# Altium schematic sheet ADC_1_PLEIADES.SchDoc
size Tabloid; SheetNumber: 9; SheetTotal: 10; Sheet_Name: Insert name in Document Parameters; Size: 11x17
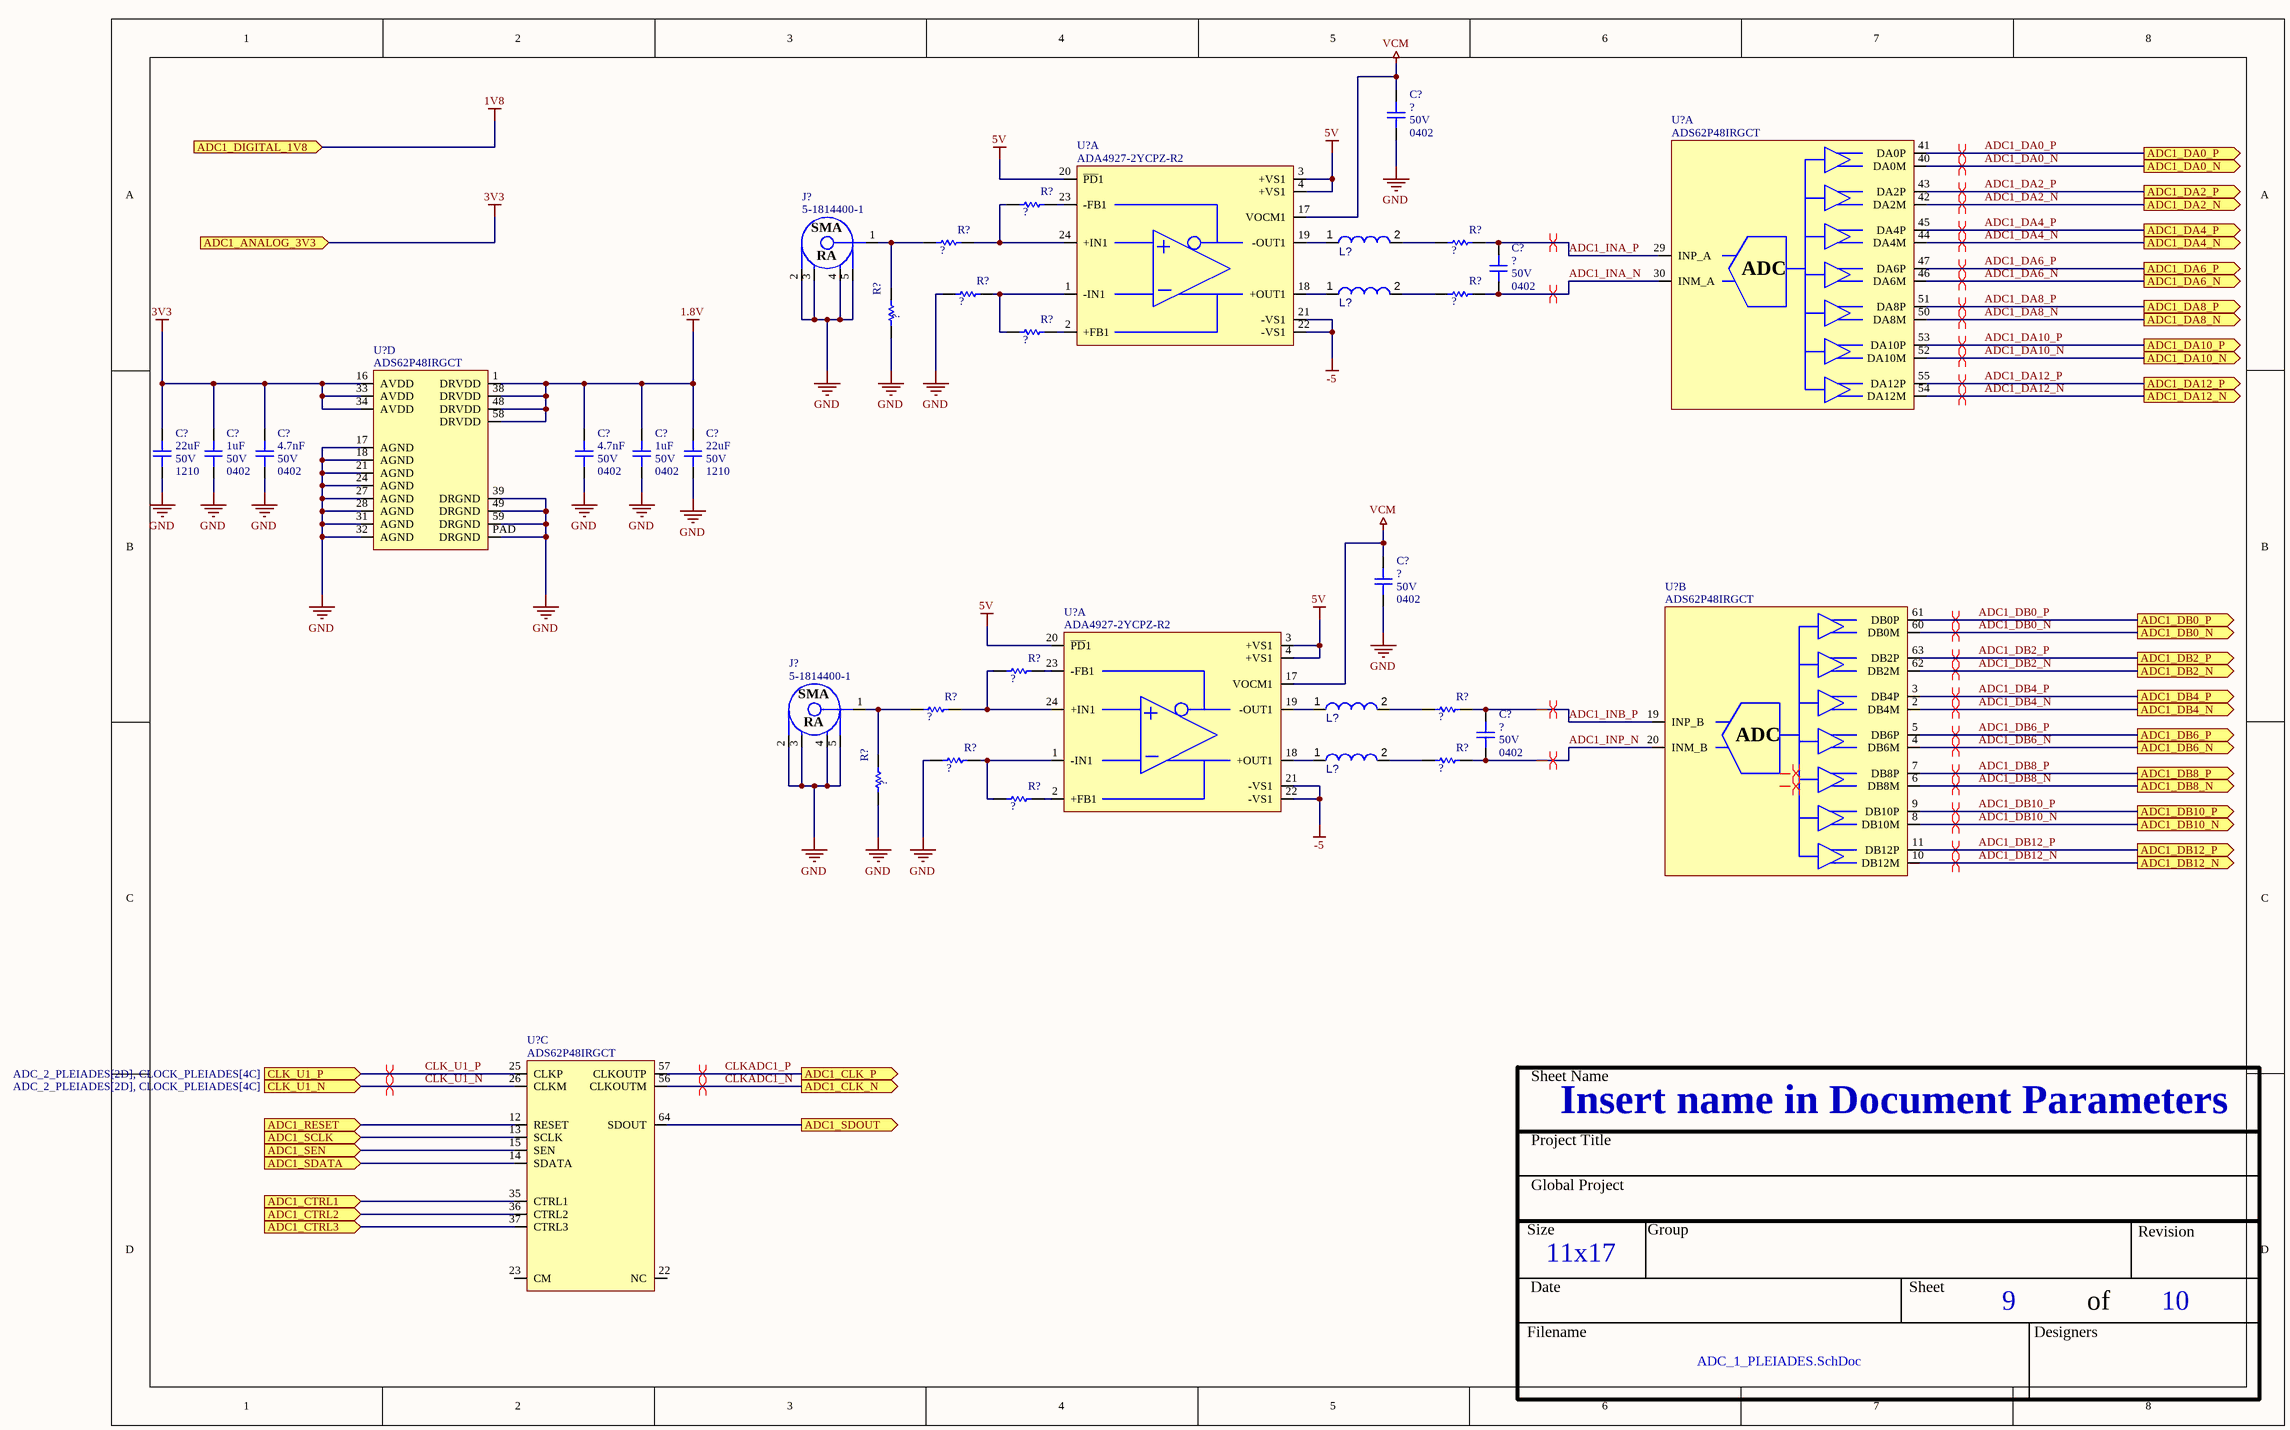
[diagram p0: ADC_1_PLEIADES.SchDoc]

## Parts
(Parts that share a designator on the sheet are numbered #1, #2 ... from top to bottom, then left to right.)
C?#1  Voltage: 50V  Package: 0402  [CAP_0402]  (hidden comment: CAP - 0402)
C?#2  Voltage: 50V  Package: 0402  [CAP_0402]  (hidden comment: CAP - 0402)
C?#3  value 22uF  Voltage: 50V  Package: 1210  [CAP_1210]  (hidden comment: CAP - 1210)
C?#4  value 1uF  Voltage: 50V  Package: 0402  [CAP_0402]  (hidden comment: CAP - 0402)
C?#5  value 4.7nF  Voltage: 50V  Package: 0402  [CAP_0402]  (hidden comment: CAP - 0402)
C?#6  value 4.7nF  Voltage: 50V  Package: 0402  [CAP_0402]  (hidden comment: CAP - 0402)
C?#7  value 1uF  Voltage: 50V  Package: 0402  [CAP_0402]  (hidden comment: CAP - 0402)
C?#8  value 22uF  Voltage: 50V  Package: 1210  [CAP_1210]  (hidden comment: CAP - 1210)
C?#9  Voltage: 50V  Package: 0402  [CAP_0402]  (hidden comment: CAP - 0402)
C?#10  Voltage: 50V  Package: 0402  [CAP_0402]  (hidden comment: CAP - 0402)
J?#1  5-1814400-1  [CONN_SMA_5-1814400-1]
J?#2  5-1814400-1  [CONN_SMA_5-1814400-1]
L?#1  RL622-102K-RC  [INDR62-500-1100X850X1100]  (value not drawn)
L?#2  RL622-102K-RC  [INDR62-500-1100X850X1100]  (value not drawn)
L?#3  RL622-102K-RC  [INDR62-500-1100X850X1100]  (value not drawn)
L?#4  RL622-102K-RC  [INDR62-500-1100X850X1100]  (value not drawn)
R?#1  RES - 0402  [RES_0402]  (value not drawn)
R?#2  RES - 0402  [RES_0402]  (value not drawn)
R?#3  RES - 0402  [RES_0402]  (value not drawn)
R?#4  RES - 0402  [RES_0402]  (value not drawn)
R?#5  RES - 0402  [RES_0402]  (value not drawn)
R?#6  RES - 0402  [RES_0402]  (value not drawn)
R?#7  RES - 0402  [RES_0402]  (value not drawn)
R?#8  RES - 0402  [RES_0402]  (value not drawn)
R?#9  RES - 0402  [RES_0402]  (value not drawn)
R?#10  RES - 0402  [RES_0402]  (value not drawn)
R?#11  RES - 0402  [RES_0402]  (value not drawn)
R?#12  RES - 0402  [RES_0402]  (value not drawn)
R?#13  RES - 0402  [RES_0402]  (value not drawn)
R?#14  RES - 0402  [RES_0402]  (value not drawn)
U?#1  ADS62P48IRGCT  [ADC_ADS62P48IRGCT]  (part A of 4)
U?#2  ADA4927-2YCPZ-R2  [OPAMP_ADA4927-2YCPZ-R2]  (part A of 2)
U?#3  ADS62P48IRGCT  [ADC_ADS62P48IRGCT]  (part D of 4)
U?#4  ADS62P48IRGCT  [ADC_ADS62P48IRGCT]  (part B of 4)
U?#5  ADA4927-2YCPZ-R2  [OPAMP_ADA4927-2YCPZ-R2]  (part A of 2)
U?#6  ADS62P48IRGCT  [ADC_ADS62P48IRGCT]  (part C of 4)

## Ports
ADC1_ANALOG_3V3 (in), ADC1_CLK_N (out), ADC1_CLK_P (out), ADC1_CTRL1 (in), ADC1_CTRL2 (in), ADC1_CTRL3 (in), ADC1_DA0_N (out), ADC1_DA0_P (out), ADC1_DA2_N (out), ADC1_DA2_P (out), ADC1_DA4_N (out), ADC1_DA4_P (out), ADC1_DA6_N (out), ADC1_DA6_P (out), ADC1_DA8_N (out), ADC1_DA8_P (out), ADC1_DA10_N (out), ADC1_DA10_P (out), ADC1_DA12_N (out), ADC1_DA12_P (out), ADC1_DB0_N (out), ADC1_DB0_P (out), ADC1_DB2_N (out), ADC1_DB2_P (out), ADC1_DB4_N (out), ADC1_DB4_P (out), ADC1_DB6_N (out), ADC1_DB6_P (out), ADC1_DB8_N (out), ADC1_DB8_P (out), ADC1_DB10_N (out), ADC1_DB10_P (out), ADC1_DB12_N (out), ADC1_DB12_P (out), ADC1_DIGITAL_1V8 (in), ADC1_RESET (in), ADC1_SCLK (in), ADC1_SDATA (in), ADC1_SDOUT (out), ADC1_SEN (in), CLK_U1_N (in, see ADC_2_PLEIADES[2D], CLOCK_PLEIADES[4C]), CLK_U1_P (in, see ADC_2_PLEIADES[2D], CLOCK_PLEIADES[4C])

## Nets
1.8V: C?#6.2 C?#7.2 C?#8.2 U?#3.1(DRVDD) U?#3.38(DRVDD) U?#3.48(DRVDD) U?#3.58(DRVDD)
1V8: port ADC1_DIGITAL_1V8
3V3: C?#3.2 C?#4.2 C?#5.2 U?#3.16(AVDD) U?#3.33(AVDD) U?#3.34(AVDD) ; port ADC1_ANALOG_3V3
5V: U?#2.3(+VS1) U?#2.4(+VS1) U?#2.20(~{PD}1) U?#5.3(+VS1) U?#5.4(+VS1) U?#5.20(~{PD}1)
-5: U?#2.21(-VS1) U?#2.22(-VS1) U?#5.21(-VS1) U?#5.22(-VS1)
GND: C?#1.1 C?#3.1 C?#4.1 C?#5.1 C?#6.1 C?#7.1 C?#8.1 C?#9.1 J?#1.2 J?#1.3 J?#1.4 J?#1.5 J?#2.2 J?#2.3 J?#2.4 J?#2.5 R?#4.1 R?#6.1 R?#11.1 R?#13.1 U?#3.17(AGND) U?#3.18(AGND) U?#3.21(AGND) U?#3.24(AGND) U?#3.27(AGND) U?#3.28(AGND) U?#3.31(AGND) U?#3.32(AGND) U?#3.39(DRGND) U?#3.49(DRGND) U?#3.59(DRGND) U?#3.PAD(DRGND)
VCM: C?#1.2 C?#9.2 U?#2.17(VOCM1) U?#5.17(VOCM1)
ADC1_CTRL1: U?#6.35(CTRL1) ; port ADC1_CTRL1
ADC1_CTRL2: U?#6.36(CTRL2) ; port ADC1_CTRL2
ADC1_CTRL3: U?#6.37(CTRL3) ; port ADC1_CTRL3
ADC1_DA0_N: U?#1.40(DA0M) ; port ADC1_DA0_N
ADC1_DA0_P: U?#1.41(DA0P) ; port ADC1_DA0_P
ADC1_DA2_N: U?#1.42(DA2M) ; port ADC1_DA2_N
ADC1_DA2_P: U?#1.43(DA2P) ; port ADC1_DA2_P
ADC1_DA4_N: U?#1.44(DA4M) ; port ADC1_DA4_N
ADC1_DA4_P: U?#1.45(DA4P) ; port ADC1_DA4_P
ADC1_DA6_N: U?#1.46(DA6M) ; port ADC1_DA6_N
ADC1_DA6_P: U?#1.47(DA6P) ; port ADC1_DA6_P
ADC1_DA8_N: U?#1.50(DA8M) ; port ADC1_DA8_N
ADC1_DA8_P: U?#1.51(DA8P) ; port ADC1_DA8_P
ADC1_DA10_N: U?#1.52(DA10M) ; port ADC1_DA10_N
ADC1_DA10_P: U?#1.53(DA10P) ; port ADC1_DA10_P
ADC1_DA12_N: U?#1.54(DA12M) ; port ADC1_DA12_N
ADC1_DA12_P: U?#1.55(DA12P) ; port ADC1_DA12_P
ADC1_DB0_N: U?#4.60(DB0M) ; port ADC1_DB0_N
ADC1_DB0_P: U?#4.61(DB0P) ; port ADC1_DB0_P
ADC1_DB2_N: U?#4.62(DB2M) ; port ADC1_DB2_N
ADC1_DB2_P: U?#4.63(DB2P) ; port ADC1_DB2_P
ADC1_DB4_N: U?#4.2(DB4M) ; port ADC1_DB4_N
ADC1_DB4_P: U?#4.3(DB4P) ; port ADC1_DB4_P
ADC1_DB6_N: U?#4.4(DB6M) ; port ADC1_DB6_N
ADC1_DB6_P: U?#4.5(DB6P) ; port ADC1_DB6_P
ADC1_DB8_N: U?#4.6(DB8M) ; port ADC1_DB8_N
ADC1_DB8_P: U?#4.7(DB8P) ; port ADC1_DB8_P
ADC1_DB10_N: U?#4.8(DB10M) ; port ADC1_DB10_N
ADC1_DB10_P: U?#4.9(DB10P) ; port ADC1_DB10_P
ADC1_DB12_N: U?#4.10(DB12M) ; port ADC1_DB12_N
ADC1_DB12_P: U?#4.11(DB12P) ; port ADC1_DB12_P
ADC1_INA_N: C?#2.1 R?#5.2 U?#1.30(INM_A)
ADC1_INA_P: C?#2.2 R?#3.2 U?#1.29(INP_A)
ADC1_INB_P: C?#10.2 R?#10.2 U?#4.19(INP_B)
ADC1_INP_N: C?#10.1 R?#12.2 U?#4.20(INM_B)
ADC1_RESET: U?#6.12(RESET) ; port ADC1_RESET
ADC1_SCLK: U?#6.13(SCLK) ; port ADC1_SCLK
ADC1_SDATA: U?#6.14(SDATA) ; port ADC1_SDATA
ADC1_SDOUT: U?#6.64(SDOUT) ; port ADC1_SDOUT
ADC1_SEN: U?#6.15(SEN) ; port ADC1_SEN
CLK_U1_N: U?#6.26(CLKM) ; port CLK_U1_N
CLK_U1_P: U?#6.25(CLKP) ; port CLK_U1_P
CLKADC1_N: U?#6.56(CLKOUTM) ; port ADC1_CLK_N
CLKADC1_P: U?#6.57(CLKOUTP) ; port ADC1_CLK_P
NetJ?#1_1: J?#1.1 R?#2.1 R?#6.2
NetJ?#2_1: J?#2.1 R?#9.1 R?#13.2
NetL?#1_1: L?#1.1 U?#2.19(-OUT1)
NetL?#1_2: L?#1.2 R?#3.1
NetL?#2_1: L?#2.1 U?#2.18(+OUT1)
NetL?#2_2: L?#2.2 R?#5.1
NetL?#3_1: L?#3.1 U?#5.19(-OUT1)
NetL?#3_2: L?#3.2 R?#10.1
NetL?#4_1: L?#4.1 U?#5.18(+OUT1)
NetL?#4_2: L?#4.2 R?#12.1
NetR?#1_1: R?#1.1 R?#2.2 U?#2.24(+IN1)
NetR?#1_2: R?#1.2 U?#2.23(-FB1)
NetR?#4_2: R?#4.2 R?#7.1 U?#2.1(-IN1)
NetR?#7_2: R?#7.2 U?#2.2(+FB1)
NetR?#8_1: R?#8.1 R?#9.2 U?#5.24(+IN1)
NetR?#8_2: R?#8.2 U?#5.23(-FB1)
NetR?#11_2: R?#11.2 R?#14.1 U?#5.1(-IN1)
NetR?#14_2: R?#14.2 U?#5.2(+FB1)

Not connected (* = marked no-connect by the designer): U?#6 22(NC) 23(CM)

## Layout directives
differential pair: (no net found under the mark), ADC1_DA0_N, ADC1_DA0_P, ADC1_DA2_N, ADC1_DA2_P, ADC1_DA4_N, ADC1_DA4_P, ADC1_DA6_N, ADC1_DA6_P, ADC1_DA8_N, ADC1_DA8_P, ADC1_DA10_N, ADC1_DA10_P, ADC1_DA12_N, ADC1_DA12_P, ADC1_DB0_N, ADC1_DB0_P, ADC1_DB2_N, ADC1_DB2_P, ADC1_DB4_N, ADC1_DB4_P, ADC1_DB6_N, ADC1_DB6_P, ADC1_DB8_N, ADC1_DB8_P, ADC1_DB10_N, ADC1_DB10_P, ADC1_DB12_N, ADC1_DB12_P, ADC1_INA_N, ADC1_INA_P, ADC1_INB_P, ADC1_INP_N, CLK_U1_N, CLK_U1_P, CLKADC1_N, CLKADC1_P

## Notes on the sheet
- Sheet Name
- Project Title
- Global Project
- Size
- Group
- Revision
- Date
- Sheet
- of
- Filename
- Designers
- (in symbol ADC_ADS62P48IRGCT, part A) ADC
- (in symbol ADC_ADS62P48IRGCT, part B) ADC
- (in symbol CONN_SMA_5-1814400-1) SMA; RA

## Library data of the parts
C?#1 C?#2 C?#4-C?#7 C?#9 C?#10 = CAP - 0402: Precision: 10%; Current: *; CreatedBy: Jonathan Bouchard; Power: *
  C?#1 C?#2 C?#9 C?#10: Value: ?
C?#3 C?#8 = CAP - 1210: Precision: 10%; Current: *; CreatedBy: Jonathan Bouchard; Power: *
J?#1 J?#2 = CONN_SMA_5-1814400-1: CONN -  SMA JACK R/A 50 OHM - TH; Mfg: TE Connectivity AMP Connectors; Voltage: *; Current: *; Power: *; Mfg Part Number: 5-1814400-1; HelpURL: http://www.te.com/commerce/DocumentDelivery/DDEController?Action=srchrtrv&DocNm=1814400&DocType=Customer+Drawing&DocLang=English; CreatedBy: Jonathan Bouchard; Temperature: -55°C ~ 85°C; Value: *; Precision: *; Package: TH-5; Supplier 1: Digikey; Supplier Part Number 1: A97593-ND
L?#1-L?#4 = CMP-006-00014-6: Radial Inductor, 1 mH, +/- 10%, 290 mA, -55 to 105 degC, 2-Pin THD, RoHS, Bulk; Manufacturer: Bourns; Shielding: Unshielded; Self Resonant Frequency: 1.3MHz; Core Material: Ferrite; Q Factor: 50; Current Rating: 290mA; Resistance: 2.9Ohm; Tolerance: 10%; Package Reference: INDR62-500-1100X850X1100; Mounting Technology: TH; Lead Pitch: 5mm; Packaging: Bulk; Package Description: 2-Pin Radial Lead, Dia 8.5 mm, Pitch 5 mm; Max Operating Temperature: 105°C; Package Quantity: 100; Datasheet URL: https://www.bourns.com/pdfs/rl622_series.pdf; Inductance Tolerance: 10%; Datasheet Version: Aug-10; Pins: 2; Case/Package: Radial; Diameter: 8.5mm; Min Operating Temperature: -55°C; RoHS Compliant: True
R?#1-R?#14 = RES - 0402: Voltage: 50V; Power: 1/16W; Precision: 1%; Current: *; CreatedBy: Jonathan Bouchard; Package: 0402; Value: ?
U?#1 U?#3 U?#4 U?#6 = ADC_ADS62P48IRGCT: ADC - 14 BIT 210MSPS SUAL - VQFN-64; Voltage: 3.15 V ~ 3.6 V / 1.7 V ~ 1.9 V; Mfg: Texas Instruments; Precision: 14 Bit; Current: *; Power: *; Mfg Part Number: ADS62P48IRGCT; HelpURL: http://www.ti.com/lit/ds/symlink/ads62p48.pdf; CreatedBy: Jonathan Bouchard; Temperature: -40°C ~ 85°C; Value: *; Package: VQFN-64; Supplier 1: Digikey; Supplier Part Number 1: 296-24611-1-ND
U?#2 U?#5 = OPAMP_ADA4927-2YCPZ-R2: OPAMP - CFA 2.3GHZ - QFN-24; Voltage: 4.5 V ~ 11 V, ±2.25 V ~ 5.5 V; Current: 65mA; Mfg: Analog Devices; Power: *; Mfg Part Number: ADA4927-2YCPZ-R2; HelpURL: http://www.analog.com/media/en/technical-documentation/data-sheets/ADA4927-1_4927-2.pdf; CreatedBy: Jonathan Bouchard; Temperature: -40°C ~ 105°C; Value: *; Precision: *; Package: QFN-24; Supplier 1: Digikey; Supplier Part Number 1: ADA4927-2YCPZ-R2CT-ND